# Altium schematic sheet Sheet_1_2021-03-03.schdoc
size 543 x 347 mm
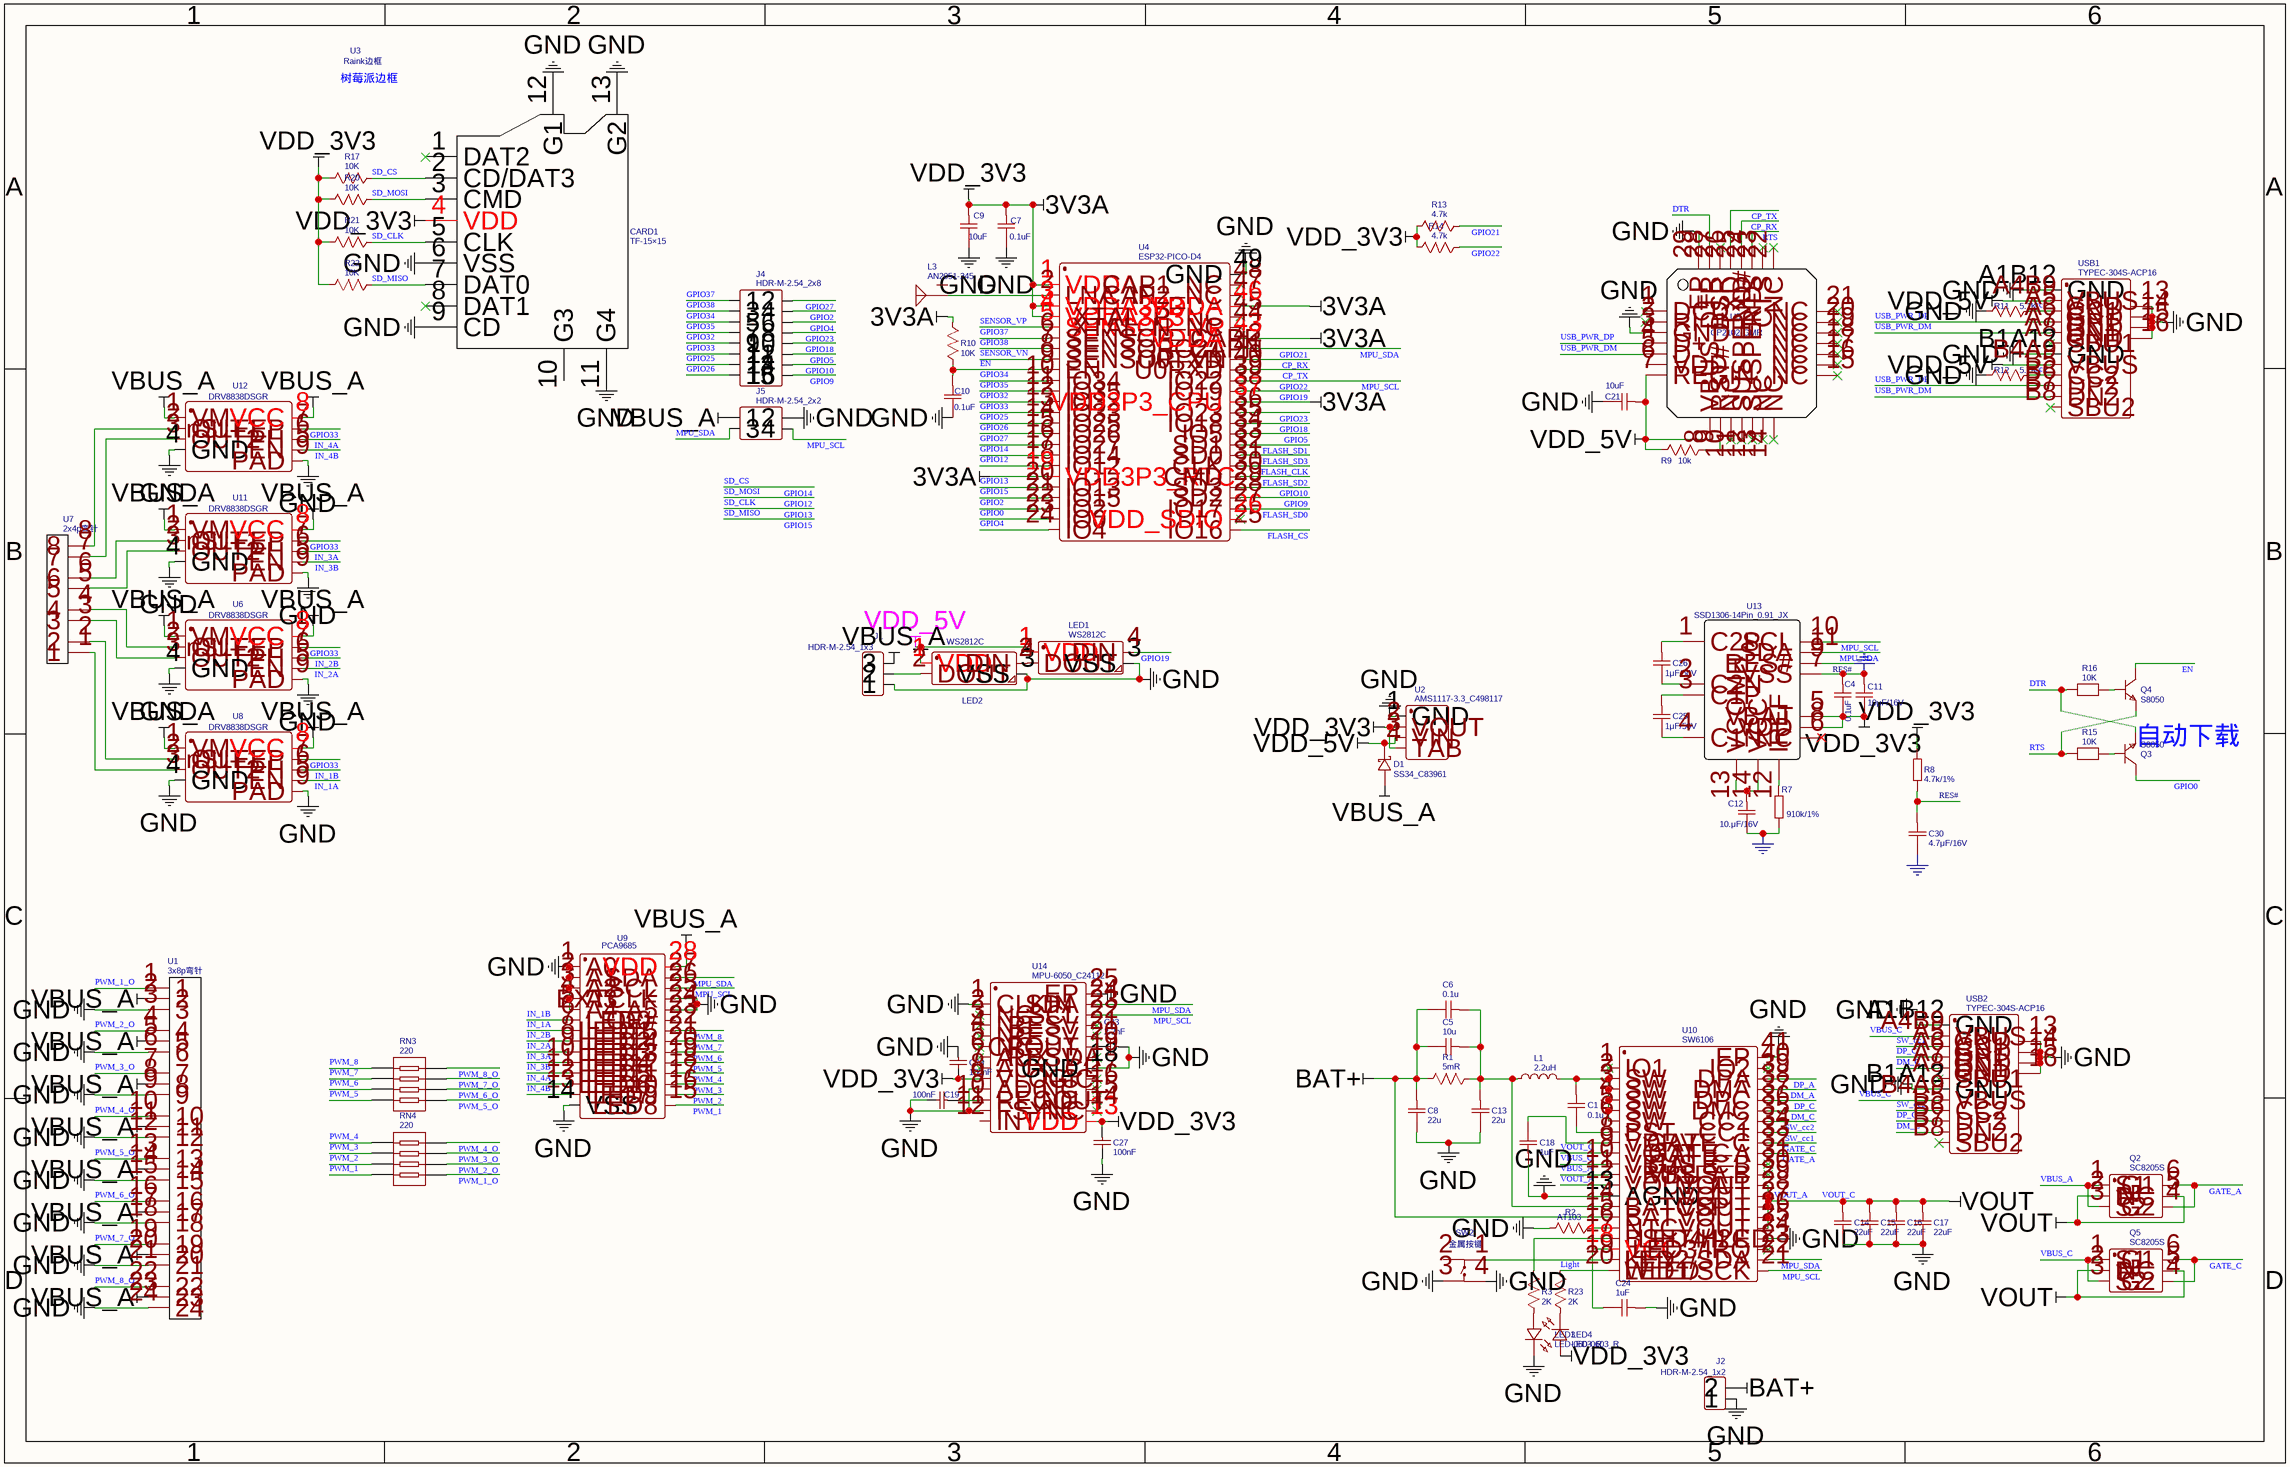
[diagram p0: Sheet_1_2021-03-03.schdoc]

## Parts
C1  0.1u  [C0603]
C4  0.1uF  [C0402]
C5  10u  [C0603]
C6  0.1u  [C0603]
C7  0.1uF  [C0603]
C8  22u  [C0805]
C9  10uF  [C0603]
C10  0.1uF  [C0402]
C11  10μF/16V  [C0402]
C12  10.μF/16V  [C0402]
C13  22u  [C0805]
C14  22uF  [C0603]
C15  22uF  [C0603]
C16  22uF  [C0603]
C17  22uF  [C0603]
C18  1uF  [C0402]
C19  100nF  [C0402]
C21  10uF  [C0402]
C24  1uF  [C0402]
C25  1μF/50V  [C0402]
C26  1μF/50V  [C0402]
C27  100nF  [C0603]
C28  100nF  [C0402]
C30  4.7μF/16V  [C0402]
C33  2.2nF  [C0402]
CARD1  TF-15×15  [TF-SMD_TF-15-15]
D1  SS34_C83961  [SMA_L4.4-W2.8-LS5.4-RD]
J1  HDR-M-2.54_1x3  [HDR-M-2.54_1X3]
J2  HDR-M-2.54_1x2  [HDR-M-2.54_1X2]
J4  HDR-M-2.54_2x8  [HDR-M-2.54_2X8]
J5  HDR-M-2.54_2x2  [HDR-M-2.54_2X2]
L1  2.2uH  [IND-SMD_L11.5-W10.0_SMMS1040]
L3  AN2051-245  [ANT2051]
LED1  WS2812C  [LED-SMD_4P-L5.0-W5.0-TL]
LED2  WS2812C  [LED-SMD_4P-L5.0-W5.0-TL]
LED3  LED-0603_R  [LED0603_RED]
LED4  LED-0603_R  [LED0603_RED]
Q2  SC8205S  [SOT-23-6_L2.9-W1.6-P0.95-LS2.8-BR]
Q3  S8050  [SOT-23_L2.9-W1.3-P0.95-LS2.4-BR]
Q4  S8050  [SOT-23_L2.9-W1.3-P0.95-LS2.4-BR]
Q5  SC8205S  [SOT-23-6_L2.9-W1.6-P0.95-LS2.8-BR]
R1  5mR  [R1206]
R2  AT103  [R0603]
R3  2K  [R0402]
R7  910k/1%  [R0603]
R8  4.7k/1%  [R0402]
R9  10k  [R0402]
R10  10K  [R0402]
R11  5.1K  [R0402]
R12  5.1K  [R0402]
R13  4.7k  [R0402]
R14  4.7k  [R0402]
R15  10K  [R0402]
R16  10K  [R0402]
R17  10K  [R0402]
R20  10K  [R0402]
R21  10K  [R0402]
R22  10K  [R0402]
R23  2K  [R0402]
RN3  220  [RES-ARRAY-SMD_0603-8P-L3.2-W1.6-BL]
RN4  220  [RES-ARRAY-SMD_0603-8P-L3.2-W1.6-BL]
SW2  金属按键  [SW-SMD_4P-L5.1-W5.1-P3.70-LS6.5]
U1  3x8p弯针  [3X8P弯针]
U2  AMS1117-3.3_C498117  [PG-SOT223-4_L6.5-W3.5-P2.30-LS7.0-BR]
U3  Raink边框  [RAINK]
U4  ESP32-PICO-D4  [QFN-48_L7.0-W7.0-P0.50-BL-EP4.1]
U5  CP2102-GMR  [QFN-28_L5.0-W5.0-P0.50-BL-EP]
U6  DRV8838DSGR  [WSON-8_L2.0-W2.0-P0.50-TL-EP]
U7  2x4p弯针  [2X4P弯针]
U8  DRV8838DSGR  [WSON-8_L2.0-W2.0-P0.50-TL-EP]
U9  PCA9685  [TSSOP-28_L9.7-W4.4-P0.65-LS6.4-BL]
U10  SW6106  [QFN-40_L6.0-W6.0-P0.50-BL-EP4.5]
U11  DRV8838DSGR  [WSON-8_L2.0-W2.0-P0.50-TL-EP]
U12  DRV8838DSGR  [WSON-8_L2.0-W2.0-P0.50-TL-EP]
U13  SSD1306-14Pin_0.91_JX  [SSD1306-14PIN_0.91_JX]
U14  MPU-6050_C24112  [QFN-24_L4.0-W4.0-P0.50-BL-EP2.6]
USB1  TYPEC-304S-ACP16  [USB-C-SMD_TYPEC-304S-ACP16]
USB2  TYPEC-304S-ACP16  [USB-C-SMD_TYPEC-304S-ACP16]

## Nets
3V3A: C4.1 C7.2 C9.2 C11.1 C27.1 C28.2 CARD1.4(VDD) LED4.1 R8.2 R10.2 R13.1 R14.1 R17.1 R20.1 R21.1 R22.1 U2.2(VOUT) U2.4(TAB) U4.1(VDDA) U4.3(VDDA3P3) U4.4(VDDA3P3) U4.19(VDD3P3_RTC) U4.37(VDD3P3_CPU) U4.43(VDDA) U4.46(VDDA) U13.5(VBAT) U13.8(VDD) U14.8(VLOGIC) U14.13(VDD)  [also labelled VDD_3V3]
BAT+: C5.1 C6.1 C8.2 J2.2 R1.1 U10.15(BAT)
GND: C4.2 C7.1 C8.1 C9.1 C10.1 C11.2 C12.1 C13.1 C14.1 C15.1 C16.1 C17.1 C18.2 C19.2 C21.1 C24.2 C27.2 C28.1 C30.1 C33.1 CARD1.6(VSS) CARD1.9(CD) CARD1.11(G4) CARD1.12(G1) CARD1.13(G2) J1.1 J2.1 J5.2 LED1.3(VSS) LED2.3(VSS) LED3.2 R2.1 R7.1 R11.2 R12.2 SW2.3 SW2.4 U1.3 U1.6 U1.9 U1.12 U1.15 U1.18 U1.21 U1.24 U2.1(GND) U4.49(GND) U5.3(GND) U5.29(EP) U6.4(GND) U6.9(PAD) U8.4(GND) U8.9(PAD) U9.1(A0) U9.2(A1) U9.3(A2) U9.4(A3) U9.5(A4) U9.14(VSS) U9.24(A5) U9.25(EXTCLK) U10.13(AGND) U10.24(LED4/I2C) U10.41(EP) U11.4(GND) U11.9(PAD) U12.4(GND) U12.9(PAD) U13.7(VSS) U14.1(CLKIN) U14.9(AD0) U14.11(FSYNC) U14.18(GND) U14.25(EP) USB1.13(GND) USB1.14(GND) USB1.15(GND) USB1.16(GND) USB1.A1B12(GND) USB1.B1A12(GND) USB2.13(GND) USB2.14(GND) USB2.15(GND) USB2.16(GND) USB2.A1B12(GND) USB2.B1A12(GND)
VBUS_A: D1.2(A) J1.3 J5.1 Q2.1(S1) Q2.3(S2) U1.2 U1.5 U1.8 U1.11 U1.14 U1.17 U1.20 U1.23 U6.1(VM) U6.8(VCC) U8.1(VM) U8.8(VCC) U9.28(VDD) U10.11(VBUS_A) U11.1(VM) U11.8(VCC) U12.1(VM) U12.8(VCC)
VDD_5V: C21.2 D1.1(C) LED1.1(VDD) LED2.1(VDD) R9.1 U2.3(VIN) U5.7(REGIN) U5.8(VBUS) USB1.A4B9(VBUS) USB1.B4A9(VBUS)
VOUT_A: C14.2 C15.2 C16.2 C17.2 Q2.2(D) Q2.5(NC) Q5.2(D) Q5.5(NC) U10.9(VOUT_C) U10.12(VOUT_A) U10.25(VOUT) U10.26(VOUT) U10.27(VOUT) U10.28(VOUT) U10.29(VOUT)  [also labelled VOUT, VOUT_C]
cc1: R11.1 USB1.A5(CC1)
cc2: R12.1 USB1.B5(CC2)
CP_RX: U4.41(U0TXD) U5.25(RXD)
CP_TX: U4.40(U0RXD) U5.26(TXD)
DM_A: U10.38(DMA)
DM_C: U10.36(DMC) USB2.A7(DN1) USB2.B7(DN2)
DP_A: U10.39(DPA)
DP_C: U10.37(DPC) USB2.A6(DP1) USB2.B6(DP2)
DTR: Q3.2(E) R16.1 U5.28(DTR)
EN: C10.2 Q4.3(C) R10.1 U4.9(EN)
FLASH_CLK: U4.31(CLK)
FLASH_CS: U4.25(IO16)
FLASH_SD0: U4.27(IO17)
FLASH_SD1: U4.33(SD1)
FLASH_SD2: U4.30(CMD)
FLASH_SD3: U4.32(SD0)
GATE_A: Q2.4(G2) Q2.6(G1) U10.32(GATE_A)
GATE_C: Q5.4(G2) Q5.6(G1) U10.33(GATE_C)
GPIO0: Q3.3(C) U4.23(IO0)
GPIO2: J4.4 U4.22(IO2)
GPIO4: J4.6 U4.24(IO4)
GPIO5: J4.12 U4.34(IO5)
GPIO9: J4.16 U4.28(SD2)
GPIO10: J4.14 U4.29(SD3)
GPIO12: CARD1.3(CMD) R20.2 U4.18(IO12)  [also labelled SD_MOSI]
GPIO13: CARD1.5(CLK) R21.2 U4.20(IO13)  [also labelled SD_CLK]
GPIO14: CARD1.2(CD/DAT3) R17.2 U4.17(IO14)  [also labelled SD_CS]
GPIO15: CARD1.7(DAT0) R22.2 U4.21(IO15)  [also labelled SD_MISO]
GPIO18: J4.10 U4.35(IO18)
GPIO19: LED1.4(DIN) U4.38(IO19)
GPIO21: J5.3 R13.2 U4.42(IO21) U9.27(SDA) U10.22(LED2/SDA) U13.11(SDA) U14.24(SDA)  [also labelled MPU_SDA]
GPIO22: J5.4 R14.2 U4.39(IO22) U9.26(SCL) U10.21(LED1/SCK) U13.10(SCL) U14.23(SCL)  [also labelled MPU_SCL]
GPIO23: J4.8 U4.36(IO23)
GPIO25: J4.13 U4.14(IO25)
GPIO26: J4.15 U4.15(IO26)
GPIO27: J4.2 U4.16(IO27)
GPIO32: J4.9 U4.12(IO32)
GPIO33: J4.11 U4.13(IO33) U6.7(nSLEEP) U8.7(nSLEEP) U11.7(nSLEEP) U12.7(nSLEEP)
GPIO34: J4.5 U4.10(IO34)
GPIO35: J4.7 U4.11(IO35)
GPIO37: J4.1 U4.6(SENSOR_CAPP)
GPIO38: J4.3 U4.7(SENSOR_CAPN)
IN_1A: U8.5(EN) U9.7(LED1)
IN_1B: U8.6(PH) U9.6(LED0)
IN_2A: U6.5(EN) U9.9(LED3)
IN_2B: U6.6(PH) U9.8(LED2)
IN_3A: U9.10(LED4) U11.6(PH)
IN_3B: U9.11(LED5) U11.5(EN)
IN_4A: U9.12(LED6) U12.6(PH)
IN_4B: U9.13(LED7) U12.5(EN)
Light: R23.2 U10.20(WLED)
PWM_1: RN4.4 U9.15(LED8)
PWM_1_O: RN4.5 U1.1
PWM_2: RN4.3 U9.16(LED9)
PWM_2_O: RN4.6 U1.4
PWM_3: RN4.2 U9.17(LED10)
PWM_3_O: RN4.7 U1.7
PWM_4: RN4.1 U9.18(LED11)
PWM_4_O: RN4.8 U1.10
PWM_5: RN3.4 U9.19(LED12)
PWM_5_O: RN3.5 U1.13
PWM_6: RN3.3 U9.20(LED13)
PWM_6_O: RN3.6 U1.16
PWM_7: RN3.2 U9.21(LED14)
PWM_7_O: RN3.7 U1.19
PWM_8: RN3.1 U9.22(LED15)
PWM_8_O: RN3.8 U1.22
RES#: C30.2 R8.1 U13.9(RES#)
RTS: Q4.2(E) R15.1 U5.24(RTS)
SENSOR_VN: U4.8(SENSOR_VN)
SENSOR_VP: U4.5(SENSOR_VP)
SW_cc1: U10.34(CC1) USB2.A5(CC1)
SW_cc2: U10.35(CC2) USB2.B5(CC2)
USB_PWR_DM: U5.5(D-) USB1.A7(DN1) USB1.B7(DN2)
USB_PWR_DP: U5.4(D+) USB1.A6(DP1) USB1.B6(DP2)
VBUS_C: Q5.1(S1) Q5.3(S2) U10.10(VBUS_C) USB2.A4B9(VBUS) USB2.B4A9(VBUS)
NetC1_1: C1.1 U10.7(BST)
NetC1_2: C1.2 L1.2 U10.2(SW) U10.3(SW) U10.4(SW) U10.5(SW) U10.6(SW)
NetC5_2: C5.2 C6.2 C13.2 L1.1 R1.2 U10.14(BATCSP)
NetC12_2: C12.2 U13.13(VCOMH) U13.14(VCC)
NetC18_1: C18.1 U10.8(VDRV)
NetC19_1: C19.1 U14.10(REGOUT)
NetC24_1: C24.1 U10.18(VCC)
NetC25_1: C25.1 U13.4(C1N)
NetC25_2: C25.2 U13.3(C1P)
NetC26_1: C26.1 U13.2(C2N)
NetC26_2: C26.2 U13.1(C2P)
NetC33_2: C33.2 U14.20(CPOUT)
NetJ1_2: J1.2 LED2.2(DOUT)
NetL3_1: L3.1(ANT) U4.2(LNA_IN)
NetLED1_2: LED1.2(DOUT) LED2.4(DIN)
NetLED3_1: LED3.1 R3.1
NetLED4_2: LED4.2 R23.1
NetQ3_1: Q3.1(B) R15.2
NetQ4_1: Q4.1(B) R16.2
NetR2_2: R2.2 U10.16(NTC)
NetR3_2: R3.2 U10.17(BSET/HLED)
NetR7_2: R7.2 U13.12(IREF)
NetR9_2: R9.2 U5.9(RST#)
NetSW2_1: SW2.1 U10.19(KEY)
NetU6_2: U6.2(OUT1) U7.4
NetU6_3: U6.3(OUT2) U7.3
NetU7_1: U7.1 U8.3(OUT2)
NetU7_2: U7.2 U8.2(OUT1)
NetU7_5: U7.5 U11.3(OUT2)
NetU7_6: U7.6 U11.2(OUT1)
NetU7_7: U7.7 U12.3(OUT2)
NetU7_8: U7.8 U12.2(OUT1)

Not connected (* = marked no-connect by the designer): CARD1 1(DAT2)* 8(DAT1)* 10(G3); L3 2; SW2 2; U4 26(VDD_SDIO)* 44(XTAL_N_NC)* 45(XTAL_P_NC)* 47(CAP2_NC)* 48(CAP1_NC)*; U5 1(DCD)* 2(RI)* 6(VDD) 10(NC)* 11(SUSPEND#)* 12(SUSPEND)* 13(NC)* 14(NC)* 15(NC)* 16(NC)* 17(NC)* 18(NC)* 19(NC)* 20(NC)* 21(NC)* 22(NC)* 23(CTS)* 27(DSR)*; U9 23(OE#); U10 1(IO1)* 23(LED3/IRQ)* 30(VBUS_B)* 31(GATE_B)* 40(IO2)*; U13 6(NC)*; U14 2(NC)* 3(NC)* 4(NC)* 5(NC)* 6(AUX_DA)* 7(AUX_CL)* 12(INT) 14(NC)* 15(NC)* 16(NC)* 17(NC)* 19(RESV)* 21(RESV)* 22(RESV)*; USB1 A8(SBU1)* B8(SBU2)*; USB2 A8(SBU1)* B8(SBU2)*

## Notes on the sheet
- (near Q3) 自动下载
- (in symbol Raink边框) 树莓派边框

## Library data of the parts
C1 C6 = 0.1u: nameAlias: Value(F); Contributor: LCEDA_Lib; spicePre: C; spiceSymbolName: C_0603_US
C4 C7 C10 = 0.1uF: nameAlias: Value(F); Contributor: LCEDA_Lib; spicePre: C
  C4: spiceSymbolName: C_0603_US
  C7 C10: spiceSymbolName: C_0402_US
C5 = 10u: nameAlias: Value(F); Contributor: LCEDA_Lib; spicePre: C; spiceSymbolName: C_0603_US
C8 C13 = 22u: nameAlias: Value(F); Contributor: LCEDA_Lib; spicePre: C; spiceSymbolName: C_0805_US
C9 C21 = 10uF: nameAlias: Value(F); Contributor: LCEDA_Lib; spicePre: C; spiceSymbolName: C_0402_US
C11 = 10μF/16V: BOM_Manufacturer: YAGEO; BOM_Manufacturer Part: CC0402KRX5R6BB475; nameAlias: Value(F); spicePre: C; spiceSymbolName: Capacitor; BOM_Supplier: LCSC; BOM_Supplier Part: C326586
C12 = 10.μF/16V: BOM_Manufacturer: YAGEO; BOM_Manufacturer Part: CC0402KRX5R6BB475; nameAlias: Value(F); spicePre: C; spiceSymbolName: Capacitor; BOM_Supplier: LCSC; BOM_Supplier Part: C326586
C14-C17 = 22uF: nameAlias: Value(F); Contributor: LCEDA_Lib; spicePre: C; spiceSymbolName: C_0603_US
C18 C24 = 1uF: nameAlias: Value(F); Contributor: LCEDA_Lib; spicePre: C; spiceSymbolName: C_0402_US
C19 C27 C28 = 100nF: BOM_Manufacturer Part: CL05B104KO5NNNC; BOM_Manufacturer: SAMSUNG; nameAlias: Capacitance; SMT Type: Basic; BOM_Supplier: LCSC; BOM_LCSC Assembly: Yes; BOM_Supplier Part: C1525; spicePre: C; spiceSymbolName: CL05B104KO5NNNC
C25 C26 = 1μF/50V: BOM_Manufacturer: SAMSUNG; BOM_Manufacturer Part: CL05A105KO5NNNC; nameAlias: Value(F); spicePre: C; spiceSymbolName: Capacitor; BOM_Supplier: LCSC; BOM_Supplier Part: C29266
C30 = 4.7μF/16V: BOM_Manufacturer: YAGEO; BOM_Manufacturer Part: CC0402KRX5R6BB475; nameAlias: Value(F); spicePre: C; spiceSymbolName: Capacitor; BOM_Supplier: LCSC; BOM_Supplier Part: C326586
C33 = 2.2nF: BOM_Manufacturer: FH; BOM_Manufacturer Part: 0603B222K500NT; nameAlias: Capacitance; SMT Type: Basic; BOM_Supplier: LCSC; BOM_LCSC Assembly: Yes; BOM_Supplier Part: C1604; spicePre: C; spiceSymbolName: 0603B222K500NT
CARD1 = TF-15×15: BOM_Manufacturer: SOFNG; BOM_Supplier: LCSC; BOM_Manufacturer Part: TF-15×15; BOM_Supplier Part: C111196; spicePre: C; spiceSymbolName: TF-15×15
D1 = SS34_C83961: BOM_Manufacturer: STARSEA; BOM_Manufacturer Part: SS34; SMT Type: Extend; BOM_Supplier: LCSC; image: //image.lceda.cn/szlcsc/C83961.jpg; BOM_Supplier Part: C83961; BOM_JLCPCB SMD: Yes; spicePre: D; spiceSymbolName: SS34_C83961
J1 = HDR-M-2.54_1x3: Contributor: LCEDA_Lib; BOM_Supplier Part: C180248; BOM_Supplier: LCSC; spicePre: J; spiceSymbolName: HDR-M-2.54_1x3
J2 = HDR-M-2.54_1x2: Contributor: LCEDA_Lib; BOM_Supplier Part: C124375; BOM_Supplier: LCSC; spicePre: J; spiceSymbolName: HDR-M-2.54_1x2
J4 = HDR-M-2.54_2x8: Contributor: LCEDA_Lib; BOM_Supplier Part: C68234; BOM_Supplier: LCSC; spicePre: J; spiceSymbolName: HDR-M-2.54_2x8
J5 = HDR-M-2.54_2x2: Contributor: LCEDA_Lib; BOM_Supplier Part: C66690; BOM_Supplier: LCSC; spicePre: J; spiceSymbolName: HDR-M-2.54_2x2
L1 = 2.2uH: BOM_Manufacturer: YJYCOIN; BOM_Manufacturer Part: YSPI1050-2R2M; nameAlias: Inductance; Contributor: LCSC; BOM_Supplier: LCSC; BOM_Supplier Part: C497893; spicePre: L; spiceSymbolName: YSPI1050-2R2M
L3 = AN2051-245: BOM_Manufacturer: Rainsun; BOM_Supplier: LCSC; BOM_Manufacturer Part: AN2051-245; BOM_Supplier Part: C99727; spicePre: L; spiceSymbolName: AN2051-245
LED1 LED2 = WS2812C: BOM_Manufacturer: Worldsemi; Contributor: LCSC; SMT Type: Extend; BOM_Supplier: LCSC; BOM_Manufacturer Part: WS2812C; BOM_Supplier Part: C114587; BOM_JLCPCB SMD: Yes; spicePre: L; spiceSymbolName: WS2812C
LED3 LED4 = LED-0603_R: BOM_Manufacturer: EVERLIGHT(台湾亿光); BOM_Manufacturer Part: 19-217/R6C-AL1M2VY/3T; Contributor: LCEDA_01; BOM_Supplier Part: C72044; BOM_Supplier: LCSC; spicePre: L; spiceSymbolName: LED-0603_R
Q2 Q5 = SC8205S: BOM_Manufacturer: FM; SMT Type: Extend; BOM_Supplier: LCSC; BOM_Manufacturer Part: SC8205S; image: //image.lceda.cn/szlcsc/C84684.jpg; BOM_Supplier Part: C84684; BOM_JLCPCB SMD: Yes; spicePre: Q; spiceSymbolName: SC8205S
Q3 Q4 = S8050: BOM_Manufacturer: GreenPower; Contributor: LCSC; BOM_Supplier: LCSC; BOM_Supplier Part: C414195; BOM_Manufacturer Part: S8050; spicePre: Q; spiceSymbolName: S8050_C414195
R1 = 5mR: nameAlias: Value(Ω); Contributor: LCEDA_Lib; spicePre: R; spiceSymbolName: R_1206_US
R2 = AT103: nameAlias: Value(Ω); Contributor: LCEDA_Lib; spicePre: R; spiceSymbolName: R_0603_US
R3 R23 = 2K: nameAlias: Value(Ω); Contributor: LCEDA_Lib; spicePre: R; spiceSymbolName: R_0402_US
R7 = 910k/1%: BOM_Manufacturer: YAGEO; BOM_Manufacturer Part: RC0402FR-07910KL; nameAlias: Value(Ω); spicePre: R; spiceSymbolName: Resistor; BOM_Supplier: LCSC; BOM_Supplier Part: C137927
R8 = 4.7k/1%: BOM_Manufacturer: YAGEO; BOM_Manufacturer Part: CC0402KRX5R6BB475; nameAlias: Value(Ω); spicePre: R; spiceSymbolName: Resistor; BOM_Supplier: LCSC; BOM_Supplier Part: C326586
R9 = 10k: nameAlias: Value(Ω); Contributor: LCEDA_Lib; spicePre: R; spiceSymbolName: R_0402_US
R10 R17 R20-R22 = 10K: nameAlias: Value(Ω); Contributor: LCEDA_Lib; spicePre: R; spiceSymbolName: R_0402_US
R11 R12 = 5.1K: nameAlias: Value(Ω); Contributor: LCEDA_Lib; spicePre: R; spiceSymbolName: R_0402_US
R13 R14 = 4.7k: nameAlias: Value(Ω); Contributor: LCEDA_Lib; spicePre: R; spiceSymbolName: R_0402_US
R15 R16 = 10K: BOM_Manufacturer: YAGEO; BOM_Manufacturer Part: RT0402FRD0710KL; nameAlias: Resistance (Ohms); Contributor: LCSC; BOM_Supplier: LCSC; BOM_Supplier Part: C723584; spicePre: R; spiceSymbolName: ERA3ARB103V
RN3 RN4 = 220: BOM_Manufacturer: UniOhm; BOM_Manufacturer Part: 4D03WGJ0330T5E; nameAlias: Resistance (Ohms); SMT Type: Extend; BOM_Supplier: LCSC; BOM_Supplier Part: C25508; BOM_JLCPCB SMD: Yes; spicePre: R; spiceSymbolName: 4D03WGJ0330T5E
SW2 = 金属按键: BOM_Manufacturer: XKB Connectivity; BOM_Manufacturer Part: TS-1187A-B-C-B; Contributor: LCSC; BOM_Supplier: LCSC; BOM_Supplier Part: C692460; spicePre: S; spiceSymbolName: TS-1187A-B-C-B
U1 = 3x8p弯针: Contributor: Jyishit; spicePre: U; spiceSymbolName: 3x8p弯针
U2 = AMS1117-3.3_C498117: BOM_Manufacturer: HGC(Huaguan Semicon); Contributor: LCSC; BOM_Supplier: LCSC; BOM_Supplier Part: C498117; BOM_Manufacturer Part: AMS1117-3.3; spicePre: U; spiceSymbolName: AMS1117-3.3_C498117
U3 = Raink边框: Contributor: Jyishit; spicePre: U; spiceSymbolName: Raink边框
U4 = ESP32-PICO-D4: BOM_Manufacturer: Espressif Systems; Contributor: LCSC; SMT Type: Extend; BOM_Supplier: LCSC; BOM_Supplier Part: C193707; BOM_Manufacturer Part: ESP32-PICO-D4; BOM_JLCPCB SMD: Yes; spicePre: U; spiceSymbolName: ESP32-PICO-D4
U5 = CP2102-GMR: BOM_Manufacturer: SILICON LABS; SMT Type: Basic; BOM_Supplier: LCSC; BOM_Manufacturer Part: CP2102-GMR; image: //image.lceda.cn/szlcsc/C6568.jpg; BOM_Supplier Part: C6568; BOM_JLCPCB SMD: Yes; spicePre: U; spiceSymbolName: CP2102-GMR
U6 U8 U11 U12 = DRV8838DSGR: BOM_Manufacturer: TI; SMT Type: Extend; BOM_Supplier: LCSC; BOM_Manufacturer Part: DRV8838DSGR; BOM_Supplier Part: C86667; BOM_JLCPCB SMD: Yes; spicePre: U; spiceSymbolName: DRV8838DSGR
U7 = 2x4p弯针: Contributor: SinKy; spicePre: U; spiceSymbolName: 2x4p弯针
U9 = PCA9685: BOM_Manufacturer: NXP; BOM_Manufacturer Part: PCA9685PW/Q900,118; SMT Type: Extend; BOM_Supplier: LCSC; BOM_Supplier Part: C92206; BOM_JLCPCB SMD: Yes; spicePre: U; spiceSymbolName: PCA9685PW/Q900,118
U10 = SW6106: BOM_Manufacturer: ISMARTWARE; Contributor: LCSC; SMT Type: Extend; BOM_Supplier: LCSC; BOM_Supplier Part: C406803; BOM_Manufacturer Part: SW6106; BOM_JLCPCB SMD: Yes; spicePre: U; spiceSymbolName: SW6106
U14 = MPU-6050_C24112: BOM_Manufacturer: InvenSense; sourceId: 1T5FDZYC8; SMT Type: Basic; timeStamp: 1462265206; BOM_Supplier: LCSC; BOM_Manufacturer Part: MPU-6050; BOM_LCSC Assembly: Yes; image: //image.lceda.cn/szlcsc/C24112.jpg; BOM_Supplier Part: C24112; spicePre: U; spiceSymbolName: MPU-6050_C24112
USB1 USB2 = TYPEC-304S-ACP16: BOM_Manufacturer: XUNPU; Contributor: LCSC; BOM_Supplier: LCSC; BOM_Supplier Part: C720630; BOM_Manufacturer Part: TYPEC-304S-ACP16; spicePre: U; spiceSymbolName: TYPEC-304S-ACP16
U13 = SSD1306-14Pin_0.91_JX: spicePre: U; BOM_Supplier: LCSC